# Altium schematic sheet Esquematico_TP3_parte1.SchDoc
size A4
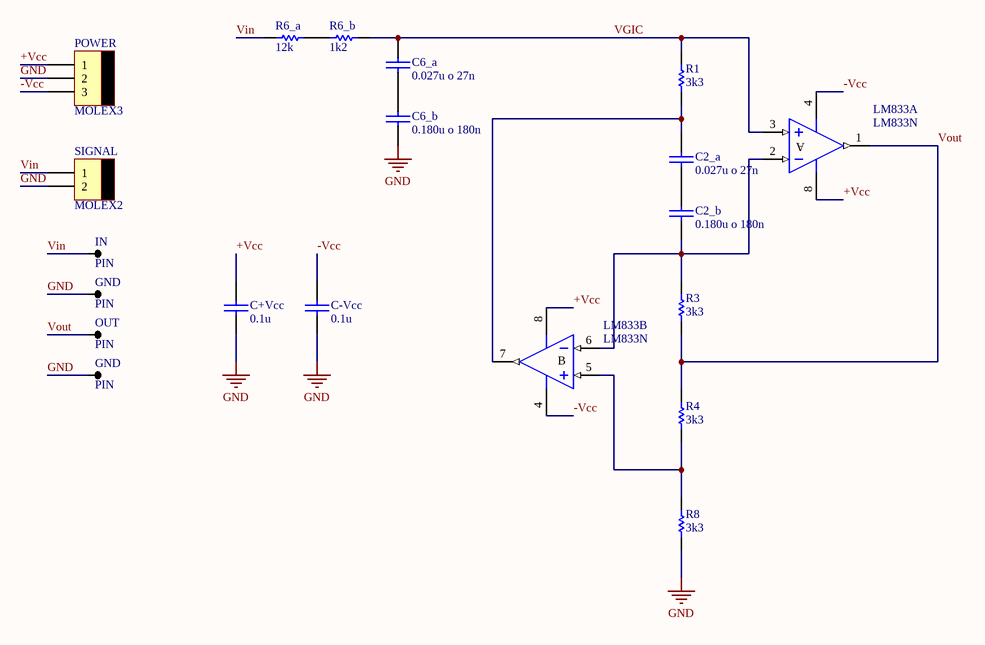
[diagram p0: Esquematico_TP3_parte1.SchDoc]

## Parts
(Parts that share a designator on the sheet are numbered #1, #2 ... from top to bottom, then left to right.)
C2_a  0.027u o 27n  [CAP200]
C2_b  0.180u o 180n  [CAP200]
C6_a  0.027u o 27n  [CAP200]
C6_b  0.180u o 180n  [CAP200]
C+Vcc  0.1u  [CAP200]
C-Vcc  0.1u  [CAP200]
GND#1  PIN  [TPSMD]
GND#2  PIN  [TPSMD]
IN  PIN  [TPSMD]
LM833  LM833N  [DIP8]  (parts A,B of 2)
OUT  PIN  [TPSMD]
POWER  MOLEX3  [MOLEX3]
R1  3k3  [RES400]
R3  3k3  [RES400]
R4  3k3  [RES400]
R6_a  12k  [RES400]
R6_b  1k2  [RES400]
R8  3k3  [RES400]
SIGNAL  MOLEX2  [MOLEX2]

## Nets
GND: C6_b.2 C+Vcc.2 C-Vcc.2 GND#1.1 GND#2.1 POWER.2 R8.2 SIGNAL.2
+Vcc: C+Vcc.1 LM833.8(V+) POWER.1
-Vcc: C-Vcc.1 LM833.4(V-) POWER.3
VGIC: C6_a.1 LM833.3(IN+) R1.1 R6_b.2
Vin: IN.1 R6_a.1 SIGNAL.1
Vout: LM833.1(OUT) OUT.1 R3.2 R4.1
NetC2_a_1: C2_a.1 LM833.7(OUT) R1.2
NetC2_a_2: C2_a.2 C2_b.1
NetC2_b_2: C2_b.2 LM833.2(IN-) LM833.6(IN-) R3.1
NetC6_a_2: C6_a.2 C6_b.1
NetLM833_5: LM833.5(IN+) R4.2 R8.1
NetR6_a_2: R6_a.2 R6_b.1

## Notes on the sheet
- (in symbol LM833N, part A) A
- (in symbol LM833N, part B) B

## Library data of the parts
C2_a C2_b C6_a C6_b C+Vcc C-Vcc = Cap: Capacitor Multicapa
GND#1 GND#2 IN OUT = TP: PIN macho
LM833 = LM833N: Low-Noise Dual Operational Amplifier; Published: 24-Aug-2001; LatestRevisionDate: 06-Jun-2005; LatestRevisionNote: Stylized 3D Model Added.; DatasheetVersion: Dec-1997; PackageReference: DIP8; Publisher: Altium Limited; PackageDescription: DIP; 8 Leads; Row Spacing 7.62 mm; Pitch 2.54 mm; Code_JEDEC: MO-001-AN; ComponentLink1Description: Manufacturer Link; ComponentLink1URL: http://www.st.com/; ComponentLink2Description: Datasheet; ComponentLink2URL: http://www.st.com/stonline/products/literature/ds/2169/lm833.pdf
POWER = MOLEX3: Alojamiento Polarizado Macho Placa 3 vias
R1 R3 R4 R6_a R6_b R8 = RES: Resistencia metal fil 10%
SIGNAL = MOLEX2: Alojamiento Polarizado Macho Placa 3 vias